# EAGLE schematic tree-v2_2 (EAGLE 6.5.0)
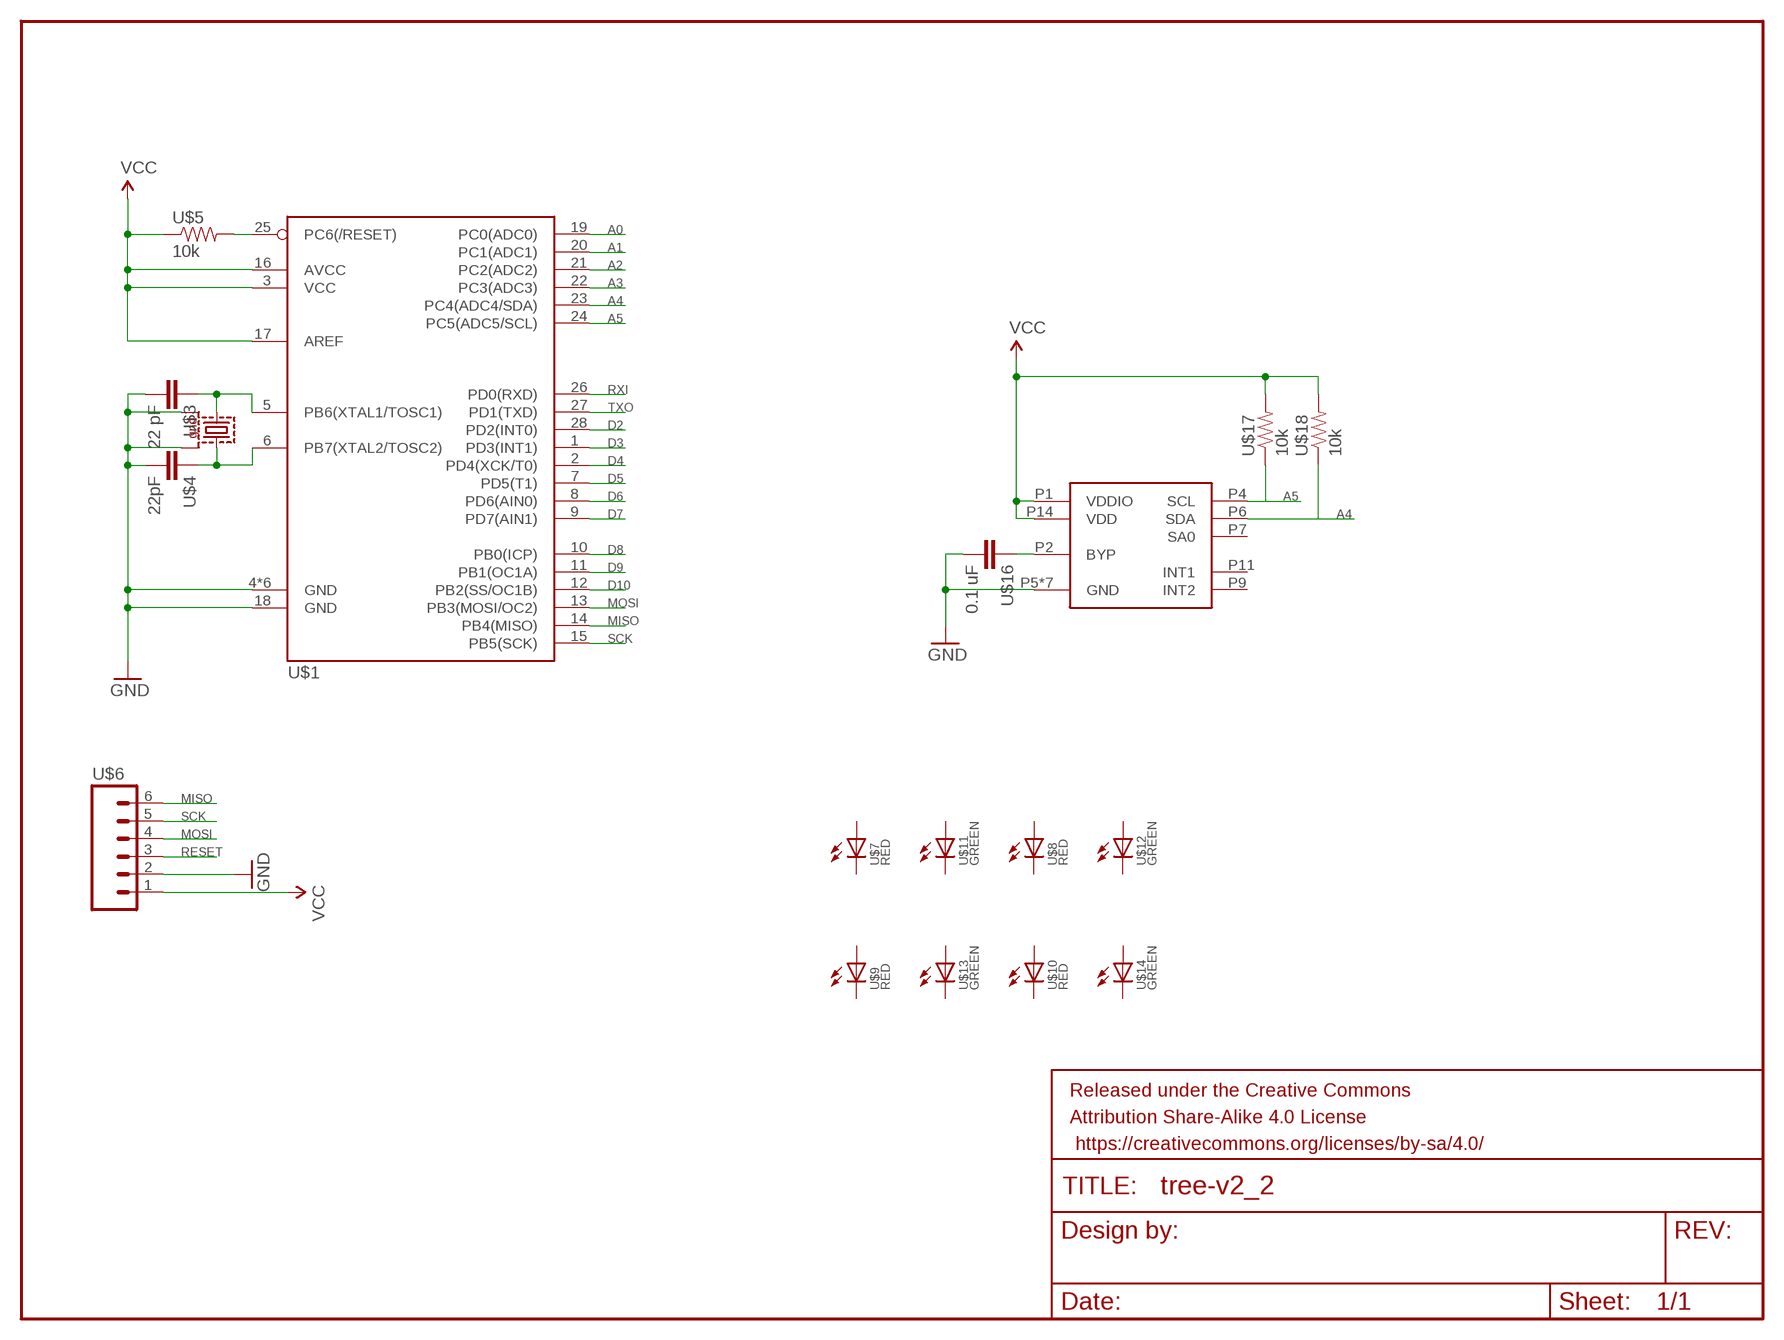
[diagram p0: schematic, sheet 1]

## Parts
FRAME1  FRAME-LETTER  [CREATIVE_COMMONS]
U$1  ATMEGA168-28PINVFQFN-28  [VQFN28]
U$2  CRYSTAL-SMD-7B-SERIES-TXC  [CRYSTAL-SMD-7B-SERIES-5X3.2MM]
U$3  22 pF  CAPCAP-0603  [CAP-0603]
U$4  22pF  CAPCAP-0603  [CAP-0603]
U$5  10k  RESISTOR0603  [RES-0603]
U$6  HRD-60.1INCH_NO_SILKSCREEN  [SIP6-SM-0.1IN-NOS.S.]
U$7  RED  LED1206  [LED-1206]
U$8  RED  LED1206  [LED-1206]
U$9  RED  LED1206  [LED-1206]
U$10  RED  LED1206  [LED-1206]
U$11  GREEN  LED1206  [LED-1206]
U$12  GREEN  LED1206  [LED-1206]
U$13  GREEN  LED1206  [LED-1206]
U$14  GREEN  LED1206  [LED-1206]
U$15  MMA_8452  [QFN-16-MMA]
U$16  0.1 uF  CAPCAP-0603  [CAP-0603]
U$17  10k  RESISTOR0603  [RES-0603]
U$18  10k  RESISTOR0603  [RES-0603]

## Nets
A0: U$1.19(PC0(ADC0))
A1: U$1.20(PC1(ADC1))
A2: U$1.21(PC2(ADC2))
A3: U$1.22(PC3(ADC3))
A4: U$1.23(PC4(ADC4/SDA)) U$15.P6(SDA) U$18.1
A5: U$1.24(PC5(ADC5/SCL)) U$15.P4(SCL) U$17.1
D2: U$1.28(PD2(INT0))
D3: U$1.1(PD3(INT1))
D4: U$1.2(PD4(XCK/T0))
D5: U$1.7(PD5(T1))
D6: U$1.8(PD6(AIN0))
D7: U$1.9(PD7(AIN1))
D8: U$1.10(PB0(ICP))
D9: U$1.11(PB1(OC1A))
D10: U$1.12(PB2(SS/OC1B))
GND: U$1.4(GND) U$1.18(GND) U$1.TH(GND) U$1.TH@1(GND) U$1.TH@2(GND) U$1.TH@3(GND) U$1.TH@4(GND) U$2.P$2 U$2.P$4 U$3.2 U$4.2 U$6.2 U$15.P5(GND) U$15.P8(GND) U$15.P10(GND) U$15.P12(GND) U$15.P13(GND) U$15.P15(GND) U$15.P16(GND) U$16.2
MISO: U$1.14(PB4(MISO)) U$6.6
MOSI: U$1.13(PB3(MOSI/OC2)) U$6.4
N$1: U$1.5(PB6(XTAL1/TOSC1)) U$2.P$1 U$3.1
N$2: U$1.6(PB7(XTAL2/TOSC2)) U$2.P$3 U$4.1
N$5: U$15.P2(BYP) U$16.1
RESET: U$1.25(PC6(/RESET)) U$5.2 U$6.3
RXI: U$1.26(PD0(RXD))
SCK: U$1.15(PB5(SCK)) U$6.5
TXO: U$1.27(PD1(TXD))
VCC: U$1.3(VCC) U$1.16(AVCC) U$1.17(AREF) U$5.1 U$6.1 U$15.P1(VDDIO) U$15.P14(VDD) U$17.2 U$18.2
Unconnected: U$7.A U$7.C U$8.A U$8.C U$9.A U$9.C U$10.A U$10.C U$11.A U$11.C U$12.A U$12.C U$13.A U$13.C U$14.A U$14.C U$15.P7(SA0) U$15.P9(INT2) U$15.P11(INT1)

## Library data of the parts
FRAME1 = SparkFun-Aesthetics:FRAME-LETTER: Schematic Frame Standard 8.5x11 US Letter frame
U$1 = LITTLEBITS140915:ATMEGA168-28PIN
U$2 = LITTLEBITS140915:CRYSTAL-SMD-7B-SERIES-TXC; MFG: TXC; MPN: 7B SERIES
U$3 U$4 U$16 = LITTLEBITS140915:CAP
U$5 U$17 U$18 = LITTLEBITS140915:RESISTOR
U$6 = LITTLEBITS140915:HRD-6
U$7-U$14 = LITTLEBITS140915:LED
U$15 = Xmas-Ornament:MMA_8452